# EAGLE design HKCV5 (EAGLE 9.6.2)
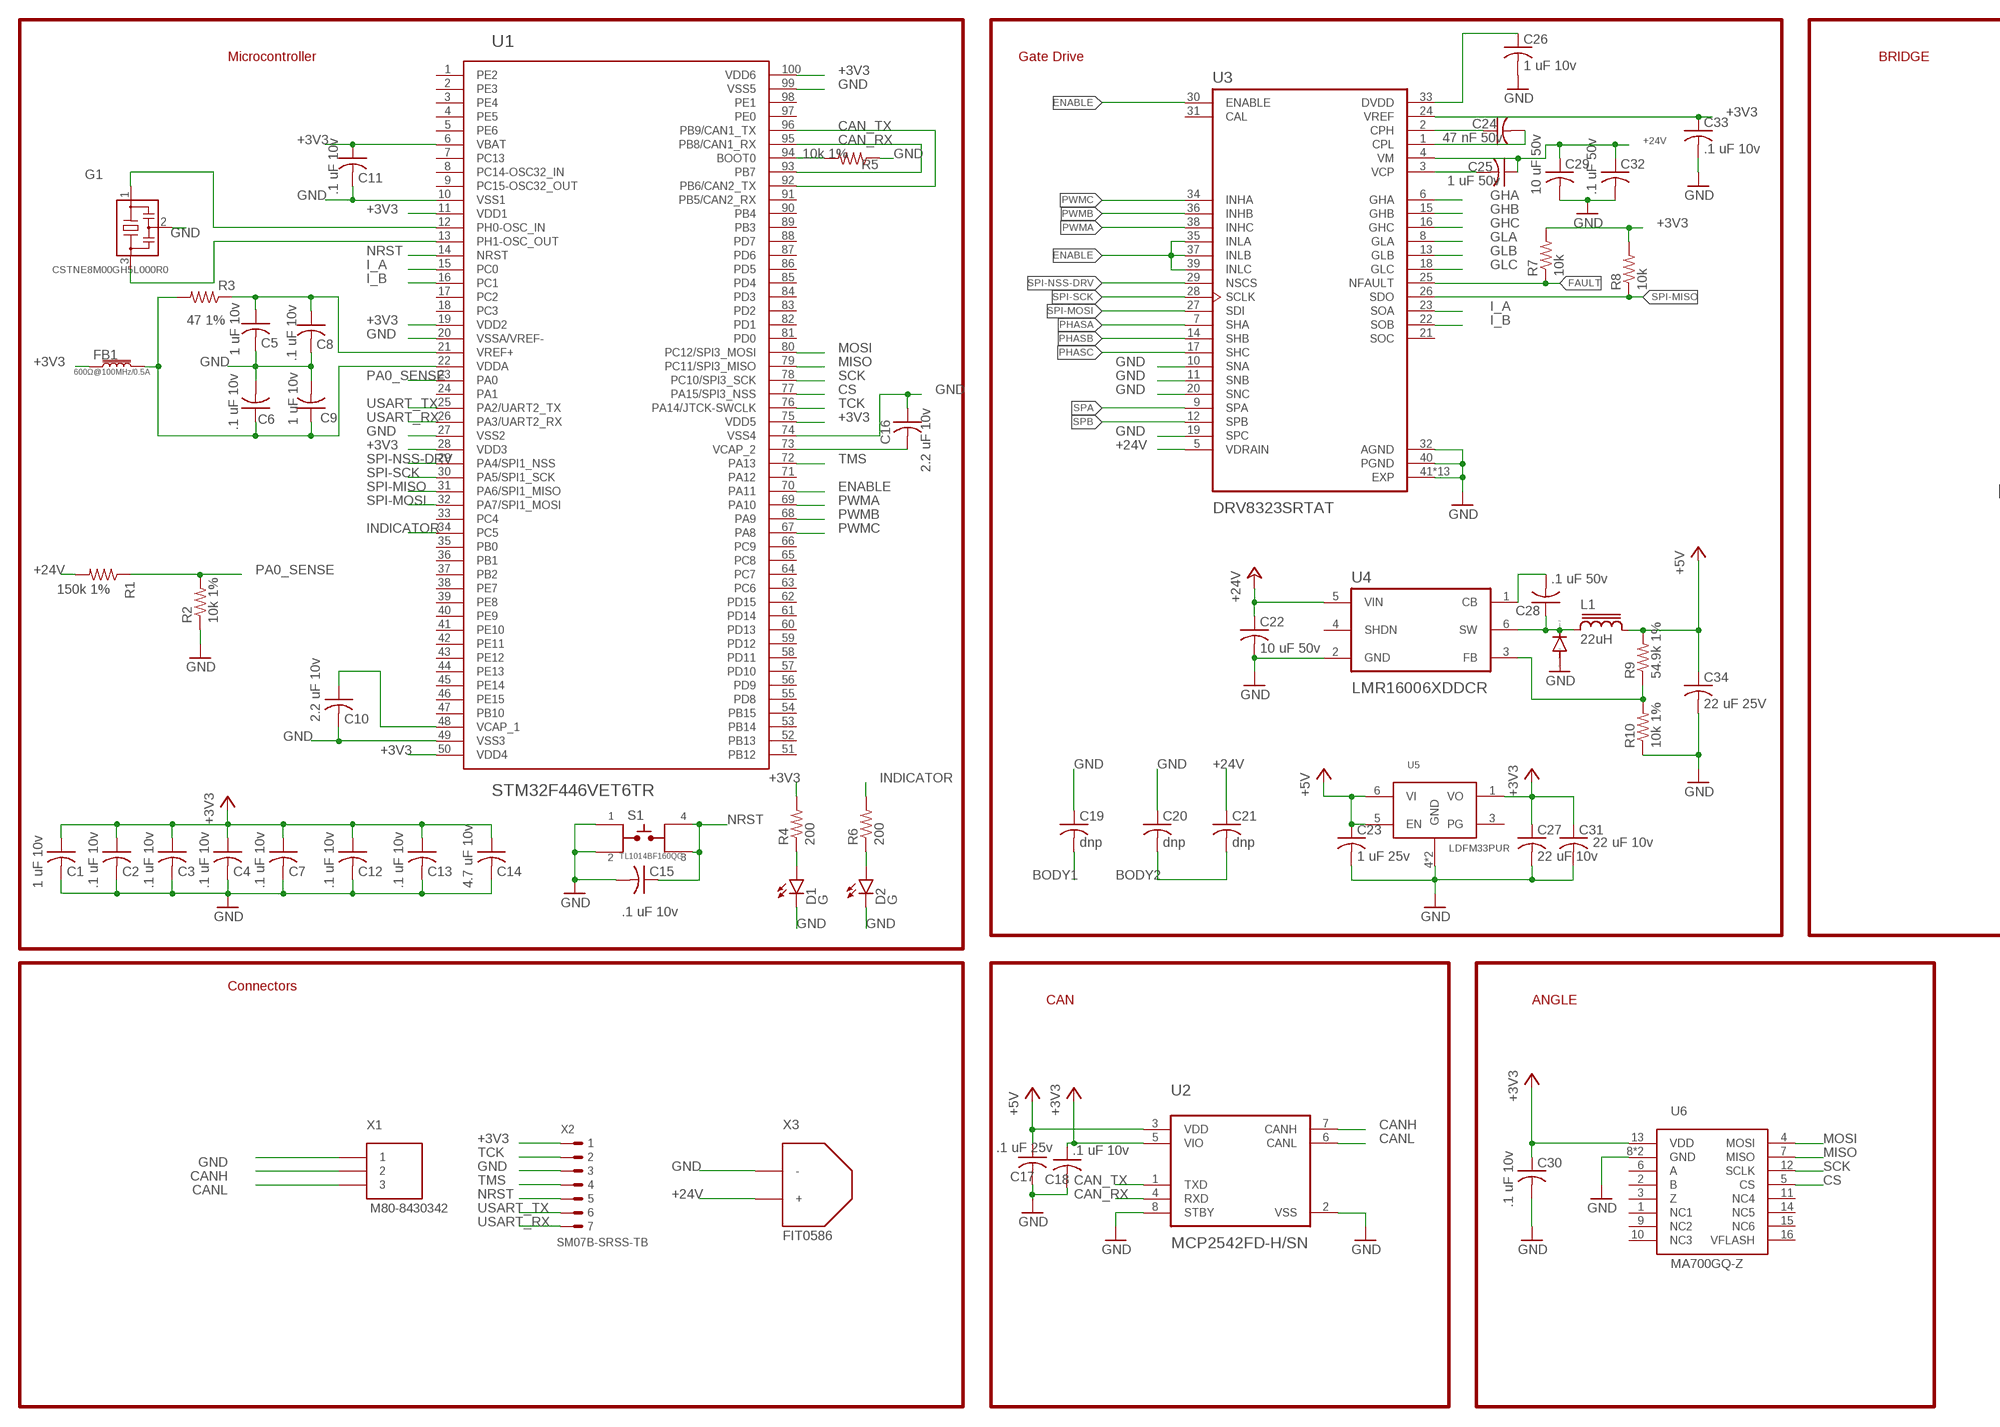
[diagram p0: schematic, sheet 1, part 1 of 2]
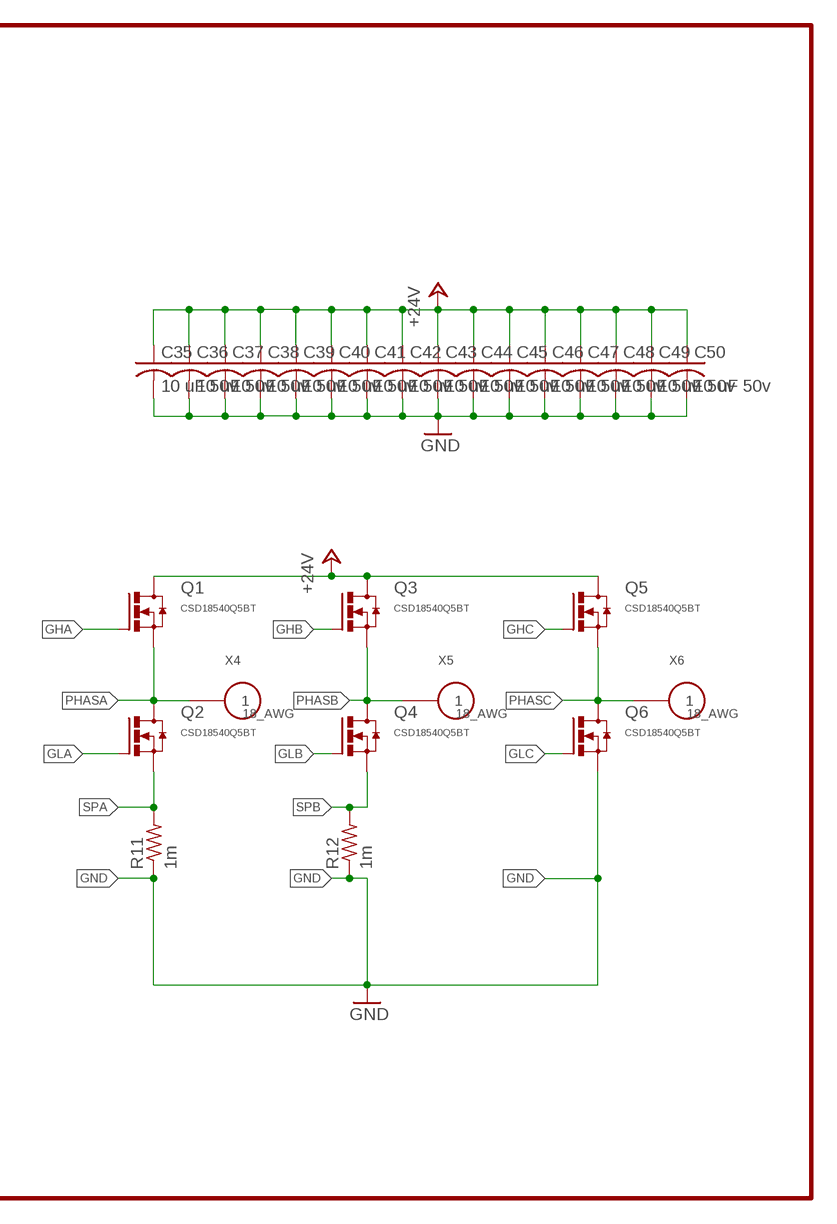
[diagram p1: schematic, sheet 1, part 2 of 2]

## Parts
C1  1 uF 10v  C-USC0402K  [C0402K]
C2  .1 uF 10v  C-USC0402K  [C0402K]
C3  .1 uF 10v  C-USC0402K  [C0402K]
C4  .1 uF 10v  C-USC0402K  [C0402K]
C5  1 uF 10v  C-USC0402K  [C0402K]
C6  .1 uF 10v  C-USC0402K  [C0402K]
C7  .1 uF 10v  C-USC0402K  [C0402K]
C8  .1 uF 10v  C-USC0402K  [C0402K]
C9  1 uF 10v  C-USC0402K  [C0402K]
C10  2.2 uF 10v  C-USC0402K  [C0402K]
C11  .1 uF 10v  C-USC0402K  [C0402K]
C12  .1 uF 10v  C-USC0402K  [C0402K]
C13  .1 uF 10v  C-USC0402K  [C0402K]
C14  4.7 uF 10v  C-USC0402K  [C0402K]
C15  .1 uF 10v  C-USC0402K  [C0402K]
C16  2.2 uF 10v  C-USC0402K  [C0402K]
C17  .1 uF 25v  C-USC0402K  [C0402K]
C18  .1 uF 10v  C-USC0402K  [C0402K]
C19  dnp  C-USC0402K  [C0402K]
C20  dnp  C-USC0402K  [C0402K]
C21  dnp  C-USC0402K  [C0402K]
C22  10 uF 50v  C-USC1206K  [C1206K]
C23  1 uF 25v  C-USC0402K  [C0402K]
C24  47 nF 50v  C-USC0402K  [C0402K]
C25  1 uF 50v  C-USC0603K  [C0603K]
C26  1 uF 10v  C-USC0402K  [C0402K]
C27  22 uF 10v  C-USC0603K  [C0603K]
C28  .1 uF 50v  C-USC0603K  [C0603K]
C29  10 uF 50v  C-USC1206K  [C1206K]
C30  .1 uF 10v  C-USC0402K  [C0402K]
C31  22 uF 10v  C-USC0603K  [C0603K]
C32  .1 uF 50v  C-USC0603K  [C0603K]
C33  .1 uF 10v  C-USC0402K  [C0402K]
C34  22 uF 25V  C-USC0805K  [C0805K]
C35  10 uF 50v  C-USC1206K  [C1206K]
C36  10 uF 50v  C-USC1206K  [C1206K]
C37  10 uF 50v  C-USC1206K  [C1206K]
C38  10 uF 50v  C-USC1206K  [C1206K]
C39  10 uF 50v  C-USC1206K  [C1206K]
C40  10 uF 50v  C-USC1206K  [C1206K]
C41  10 uF 50v  C-USC1206K  [C1206K]
C42  10 uF 50v  C-USC1206K  [C1206K]
C43  10 uF 50v  C-USC1206K  [C1206K]
C44  10 uF 50v  C-USC1206K  [C1206K]
C45  10 uF 50v  C-USC1206K  [C1206K]
C46  10 uF 50v  C-USC1206K  [C1206K]
C47  10 uF 50v  C-USC1206K  [C1206K]
C48  10 uF 50v  C-USC1206K  [C1206K]
C49  10 uF 50v  C-USC1206K  [C1206K]
C50  10 uF 50v  C-USC1206K  [C1206K]
D1  G  LED0603  [LED-0603]
D2  G  LED0603  [LED-0603]
D3  500 mA 60v  DIODE-SOD123  [SOD123]
FB1  600Ω@100MHz/0.5A  FERRITE_BEAD-0603  [0603]
G1  CSTNE8M00GH5L000R0  [CSTCE]
L1  22uH  SDR0302  [SDR0302]
Q1  CSD18540Q5BT  [8-POWERTDFN]
Q2  CSD18540Q5BT  [8-POWERTDFN]
Q3  CSD18540Q5BT  [8-POWERTDFN]
Q4  CSD18540Q5BT  [8-POWERTDFN]
Q5  CSD18540Q5BT  [8-POWERTDFN]
Q6  CSD18540Q5BT  [8-POWERTDFN]
R1  150k 1%  R-US_R0402  [R0402]
R2  10k 1%  R-US_R0402  [R0402]
R3  47 1%  R-US_R0402  [R0402]
R4  200  R-US_R0402  [R0402]
R5  10k 1%  R-US_R0402  [R0402]
R6  200  R-US_R0402  [R0402]
R7  10k  R-US_R0402  [R0402]
R8  10k  R-US_R0402  [R0402]
R9  54.9k 1%  R-US_R0402  [R0402]
R10  10k 1%  R-US_R0402  [R0402]
R11  1m  R-US_R1210  [R1210]
R12  1m  R-US_R1210  [R1210]
S1  TL1014BF160QG  [TL1014]
U1  STM32F446VET6TR  [LQFP100]
U2  MCP2542FD-H/SN  [8-LEADSOIC]
U3  DRV8323SRTAT  [RTA-PACKAGE]
U4  LMR16006XDDCR  [SOT-23-6-THIN]
U5  LDFM33PUR  [DFN6-3X3]
U6  MA700GQ-Z  MA700GQ-Z  [QFN16]
X1  M80-8430342  M80-3-PIN  [M80-8430342]
X2  SM07B-SRSS-TB  [SM07B-SRSS-TB]
X3  FIT0586  [XT30]
X4  18_AWG  18_AWG_PADSINGLE  [18_AWG_PAD]
X5  18_AWG  18_AWG_PADSINGLE  [18_AWG_PAD]
X6  18_AWG  18_AWG_PADSINGLE  [18_AWG_PAD]

## Nets
+3V3 [supply1]: C1.1 C2.1 C3.1 C4.1 C7.1 C11.1 C12.1 C13.1 C14.1 C18.1 C27.1 C30.1 C31.1 C33.1 FB1.1 R4.2 R7.2 R8.2 U1.6(VBAT) U1.11(VDD1) U1.19(VDD2) U1.28(VDD3) U1.50(VDD4) U1.75(VDD5) U1.100(VDD6) U2.5(VIO) U3.24(VREF) U5.1(VO) U6.13(VDD) X2.1
+5V [supply1]: C17.1 C23.1 C34.1 L1.2 R9.2 U2.3(VDD) U5.5(EN) U5.6(VI)
+24V [supply1]: C21.1 C22.1 C25.1 C29.1 C32.1 C35.1 C36.1 C37.1 C38.1 C39.1 C40.1 C41.1 C42.1 C43.1 C44.1 C45.1 C46.1 C47.1 C48.1 C49.1 C50.1 Q1.5_1(D) Q1.5_2(D) Q1.5_3(D) Q1.5_4(D) Q1.5_5(D) Q1.5_6(D) Q1.5_7(D) Q1.5_8(D) Q1.5_9(D) Q1.5_10(D) Q1.5_11(D) Q1.5_12(D) Q1.5_13(D) Q1.5_14(D) Q1.5_15(D) Q1.5_16(D) Q1.5_17(D) Q1.5_18(D) Q1.5_19(D) Q1.5_20(D) Q1.5_21(D) Q1.5_22(D) Q1.5_23(D) Q1.5_24(D) Q1.5_25(D) Q1.5_26(D) Q1.5_27(D) Q1.5_28(D) Q1.5_29(D) Q1.5_30(D) Q3.5_1(D) Q3.5_2(D) Q3.5_3(D) Q3.5_4(D) Q3.5_5(D) Q3.5_6(D) Q3.5_7(D) Q3.5_8(D) Q3.5_9(D) Q3.5_10(D) Q3.5_11(D) Q3.5_12(D) Q3.5_13(D) Q3.5_14(D) Q3.5_15(D) Q3.5_16(D) Q3.5_17(D) Q3.5_18(D) Q3.5_19(D) Q3.5_20(D) Q3.5_21(D) Q3.5_22(D) Q3.5_23(D) Q3.5_24(D) Q3.5_25(D) Q3.5_26(D) Q3.5_27(D) Q3.5_28(D) Q3.5_29(D) Q3.5_30(D) Q5.5_1(D) Q5.5_2(D) Q5.5_3(D) Q5.5_4(D) Q5.5_5(D) Q5.5_6(D) Q5.5_7(D) Q5.5_8(D) Q5.5_9(D) Q5.5_10(D) Q5.5_11(D) Q5.5_12(D) Q5.5_13(D) Q5.5_14(D) Q5.5_15(D) Q5.5_16(D) Q5.5_17(D) Q5.5_18(D) Q5.5_19(D) Q5.5_20(D) Q5.5_21(D) Q5.5_22(D) Q5.5_23(D) Q5.5_24(D) Q5.5_25(D) Q5.5_26(D) Q5.5_27(D) Q5.5_28(D) Q5.5_29(D) Q5.5_30(D) R1.2 U3.4(VM) U3.5(VDRAIN) U4.5(VIN) X3.+
BODY1: C19.2
BODY2: C20.2 C21.2
BOOT0: R5.2 U1.94(BOOT0)
CAN_RX: U1.93(PB7) U1.95(PB8/CAN1_RX) U2.4(RXD)
CAN_TX: U1.92(PB6/CAN2_TX) U1.96(PB9/CAN1_TX) U2.1(TXD)
CANH: U2.7(CANH) X1.2
CANL: U2.6(CANL) X1.3
CB [buck_converter]: C28.2 U4.1(CB)
CPH: C24.1 U3.2(CPH)
CPL: C24.2 U3.1(CPL)
CS: U1.77(PA15/SPI3_NSS) U6.5(CS)
D1: D1.A R4.1
D2: D2.A R6.1
DVDD [gate_drive]: C26.1 U3.33(DVDD)
ENABLE: U1.70(PA11) U3.30(ENABLE) U3.35(INLA) U3.37(INLB) U3.39(INLC)
FAULT: R7.1 U3.25(NFAULT)
FB [buck_converter]: R9.1 R10.2 U4.3(FB)
GHA [gate_drive]: Q1.4(G) U3.6(GHA)
GHB [gate_drive]: Q3.4(G) U3.15(GHB)
GHC [gate_drive]: Q5.4(G) U3.16(GHC)
GLA [gate_drive]: Q2.4(G) U3.8(GLA)
GLB [gate_drive]: Q4.4(G) U3.13(GLB)
GLC [gate_drive]: Q6.4(G) U3.18(GLC)
GND: C1.2 C2.2 C3.2 C4.2 C5.2 C6.2 C7.2 C8.2 C9.2 C10.2 C11.2 C12.2 C13.2 C14.2 C15.2 C16.1 C17.2 C18.2 C19.1 C20.1 C22.2 C23.2 C26.2 C27.2 C29.2 C30.2 C31.2 C32.2 C33.2 C34.2 C35.2 C36.2 C37.2 C38.2 C39.2 C40.2 C41.2 C42.2 C43.2 C44.2 C45.2 C46.2 C47.2 C48.2 C49.2 C50.2 D1.C D2.C D3.A G1.2 Q6.1(S) Q6.2(S) Q6.3(S) R2.1 R5.1 R10.1 R11.1 R12.1 S1.1 S1.2 U1.10(VSS1) U1.20(VSSA/VREF-) U1.27(VSS2) U1.49(VSS3) U1.74(VSS4) U1.99(VSS5) U2.2(VSS) U2.8(STBY) U3.10(SNA) U3.11(SNB) U3.19(SPC) U3.20(SNC) U3.32(AGND) U3.40(PGND) U3.41(EXP) U3.41_1(EXP) U3.41_2(EXP) U3.41_3(EXP) U3.41_4(EXP) U3.41_5(EXP) U3.41_6(EXP) U3.41_7(EXP) U3.41_8(EXP) U3.41_9(EXP) U3.41_10(EXP) U3.41_11(EXP) U3.41_12(EXP) U4.2(GND) U5.4(GND) U5.EXP(GND) U6.8(GND) U6.TH(GND) X1.1 X2.3 X3.-
I_A: U1.15(PC0) U3.23(SOA)
I_B: U1.16(PC1) U3.22(SOB)
INDICATOR: R6.2 U1.34(PC5)
MISO: U1.79(PC11/SPI3_MISO) U6.7(MISO)
MOSI: U1.80(PC12/SPI3_MOSI) U6.4(MOSI)
NRST: C15.1 S1.3 S1.4 U1.14(NRST) X2.5
OSC_IN: G1.1 U1.12(PH0-OSC_IN)
OSC_OUT: G1.3 U1.13(PH1-OSC_OUT)
PA0_SENSE: R1.1 R2.2 U1.23(PA0)
PHASA: Q1.1(S) Q1.2(S) Q1.3(S) Q2.5_1(D) Q2.5_2(D) Q2.5_3(D) Q2.5_4(D) Q2.5_5(D) Q2.5_6(D) Q2.5_7(D) Q2.5_8(D) Q2.5_9(D) Q2.5_10(D) Q2.5_11(D) Q2.5_12(D) Q2.5_13(D) Q2.5_14(D) Q2.5_15(D) Q2.5_16(D) Q2.5_17(D) Q2.5_18(D) Q2.5_19(D) Q2.5_20(D) Q2.5_21(D) Q2.5_22(D) Q2.5_23(D) Q2.5_24(D) Q2.5_25(D) Q2.5_26(D) Q2.5_27(D) Q2.5_28(D) Q2.5_29(D) Q2.5_30(D) U3.7(SHA) X4.1
PHASB: Q3.1(S) Q3.2(S) Q3.3(S) Q4.5_1(D) Q4.5_2(D) Q4.5_3(D) Q4.5_4(D) Q4.5_5(D) Q4.5_6(D) Q4.5_7(D) Q4.5_8(D) Q4.5_9(D) Q4.5_10(D) Q4.5_11(D) Q4.5_12(D) Q4.5_13(D) Q4.5_14(D) Q4.5_15(D) Q4.5_16(D) Q4.5_17(D) Q4.5_18(D) Q4.5_19(D) Q4.5_20(D) Q4.5_21(D) Q4.5_22(D) Q4.5_23(D) Q4.5_24(D) Q4.5_25(D) Q4.5_26(D) Q4.5_27(D) Q4.5_28(D) Q4.5_29(D) Q4.5_30(D) U3.14(SHB) X5.1
PHASC: Q5.1(S) Q5.2(S) Q5.3(S) Q6.5_1(D) Q6.5_2(D) Q6.5_3(D) Q6.5_4(D) Q6.5_5(D) Q6.5_6(D) Q6.5_7(D) Q6.5_8(D) Q6.5_9(D) Q6.5_10(D) Q6.5_11(D) Q6.5_12(D) Q6.5_13(D) Q6.5_14(D) Q6.5_15(D) Q6.5_16(D) Q6.5_17(D) Q6.5_18(D) Q6.5_19(D) Q6.5_20(D) Q6.5_21(D) Q6.5_22(D) Q6.5_23(D) Q6.5_24(D) Q6.5_25(D) Q6.5_26(D) Q6.5_27(D) Q6.5_28(D) Q6.5_29(D) Q6.5_30(D) U3.17(SHC) X6.1
PWMA: U1.69(PA10) U3.38(INHC)
PWMB: U1.68(PA9) U3.36(INHB)
PWMC: U1.67(PA8) U3.34(INHA)
SCK: U1.78(PC10/SPI3_SCK) U6.12(SCLK)
SPA: Q2.1(S) Q2.2(S) Q2.3(S) R11.2 U3.9(SPA)
SPB: Q4.1(S) Q4.2(S) Q4.3(S) R12.2 U3.12(SPB)
SPI-MISO: R8.1 U1.31(PA6/SPI1_MISO) U3.26(SDO)
SPI-MOSI: U1.32(PA7/SPI1_MOSI) U3.27(SDI)
SPI-NSS-DRV: U1.29(PA4/SPI1_NSS) U3.29(NSCS)
SPI-SCK: U1.30(PA5/SPI1_SCK) U3.28(SCLK)
SW [buck_converter]: C28.1 D3.C L1.1 U4.6(SW)
TCK: U1.76(PA14/JTCK-SWCLK) X2.2
TMS: U1.72(PA13) X2.4
USART_RX: U1.26(PA3/UART2_RX) X2.7
USART_TX: U1.25(PA2/UART2_TX) X2.6
VCAP_1: C10.1 U1.48(VCAP_1)
VCAP_2: C16.2 U1.73(VCAP_2)
VCP [gate_drive]: C25.2 U3.3(VCP)
VDDA: C6.1 C9.1 FB1.2 R3.2 U1.22(VDDA)
VREF+: C5.1 C8.1 R3.1 U1.21(VREF+)
Unconnected: U1.1(PE2) U1.2(PE3) U1.3(PE4) U1.4(PE5) U1.5(PE6) U1.7(PC13) U1.8(PC14-OSC32_IN) U1.9(PC15-OSC32_OUT) U1.17(PC2) U1.18(PC3) U1.24(PA1) U1.33(PC4) U1.35(PB0) U1.36(PB1) U1.37(PB2) U1.38(PE7) U1.39(PE8) U1.40(PE9) U1.41(PE10) U1.42(PE11) U1.43(PE12) U1.44(PE13) U1.45(PE14) U1.46(PE15) U1.47(PB10) U1.51(PB12) U1.52(PB13) U1.53(PB14) U1.54(PB15) U1.55(PD8) U1.56(PD9) U1.57(PD10) U1.58(PD11) U1.59(PD12) U1.60(PD13) U1.61(PD14) U1.62(PD15) U1.63(PC6) U1.64(PC7) U1.65(PC8) U1.66(PC9) U1.71(PA12) U1.81(PD0) U1.82(PD1) U1.83(PD2) U1.84(PD3) U1.85(PD4) U1.86(PD5) U1.87(PD6) U1.88(PD7) U1.89(PB3) U1.90(PB4) U1.91(PB5/CAN2_RX) U1.97(PE0) U1.98(PE1) U3.21(SOC) U3.31(CAL) U4.4(SHDN) U5.3(PG) U6.1(NC1) U6.2(B) U6.3(Z) U6.6(A) U6.9(NC2) U6.10(NC3) U6.11(NC4) U6.14(NC5) U6.15(NC6) U6.16(VFLASH)

## Notes on the sheet
- Microcontroller | Gate Drive | BRIDGE
- Connectors
- CAN | ANGLE

## Library data of the parts
C1-C50 = rcl:C-US: CAPACITOR, American symbol; SPICEPREFIX: C
D1 D2 = SparkFun-LED:LED: LED (Generic) Standard schematic elements and footprints for 5mm, 3mm, 1206, and 0603 sized LEDs. Generic LEDs with no color specified.
D3 = diode:DIODE-: DIODE
FB1 = SparkFun-Coils:FERRITE_BEAD: Ferrite Bead (blocks, cores, rings, chokes, etc.) Inductor with layers of ferrite used to suppress high frequencies. Often used to isolate high frequency noise. SparkFun Products: IOIO-OTG - V2.2 <https://www.sparkfun.com/products/13613> SparkFun SAMD21 Mini Breakout <https://www.sparkfun.com/products/13664> SparkFun 6 Degrees of Freedom Breakout - LSM6DS3 <https://www.sparkfun.com/products/13339> SparkFun SAMD21 Dev Breakout <https://www.sparkfun.com/products/13672>; PROD_ID: NDUC-07859; VALUE: 30Ω/1.8A
G1 = HKCV4:CSTNE8M00GH5L000R0: CSTNE8M00GH5L000R0
L1 = inductor-bourns:SDR0302: POWER INDUCTOR
Q1-Q6 = VaskoCustom:CSD18540Q5BT: CSD18540Q5B 60-V, N-ChannelNexFET™ PowerMOSFETs Texas Instruments
R1-R12 = rcl:R-US_: RESISTOR, American symbol; SPICEPREFIX: R
S1 = VaskoCustom:TL1014BF160QG: TL1014BF160QG Switch RATING: 12VDC, 50mA. MECHANICAL/ELECTRICAL LIFE 200,000 CYCLES MIN.
U1 = VaskoCustom:STM32F446VET6TR: STM32F446VET6TR Arm® Cortex®-M4 32-bit MCU+FPU, 225 DMIPS, up to 512 KB Flash/128+4 KB RAM, USB OTG HS/FS, seventeen TIMs, three ADCs and twenty communication interfaces
U2 = VaskoCustom:MCP2542FD-H/SN: MCP2542FD-H/SN CAN FD Transceiver
U3 = VaskoCustom:DRV8323SRTAT: DRV8323SRTAT 6 to 60-V Three-PhaseSmartGate Driver
U4 = VaskoCustom:LMR16006XDDCR: LMR16006XDDCR SIMPLESWITCHER®60 V 0.6 A Buck RegulatorsWith High Efficiency ECO Mode Texas Instruments
U5 = HKCV4:LDFM33PUR
U6 = HKCV4:MA700GQ-Z: MA700GQ-Z
X1 = HKCV4:M80-3-PIN: M80-8430342
X2 = HKCV4:SM07B-SRSS-TB: SM07B-SRSS-TB 1.0 mm pitch/Disconnectable Crimp style connectors
X3 = VaskoCustom:FIT0586
X4-X6 = HKCV4:18_AWG_PAD: 18_AWG

## Net classes
1 gate_drive: width 0.2 mm, clearance 0.25 mm
2 supply1: width 0.2 mm, clearance 0.152 mm

## Board
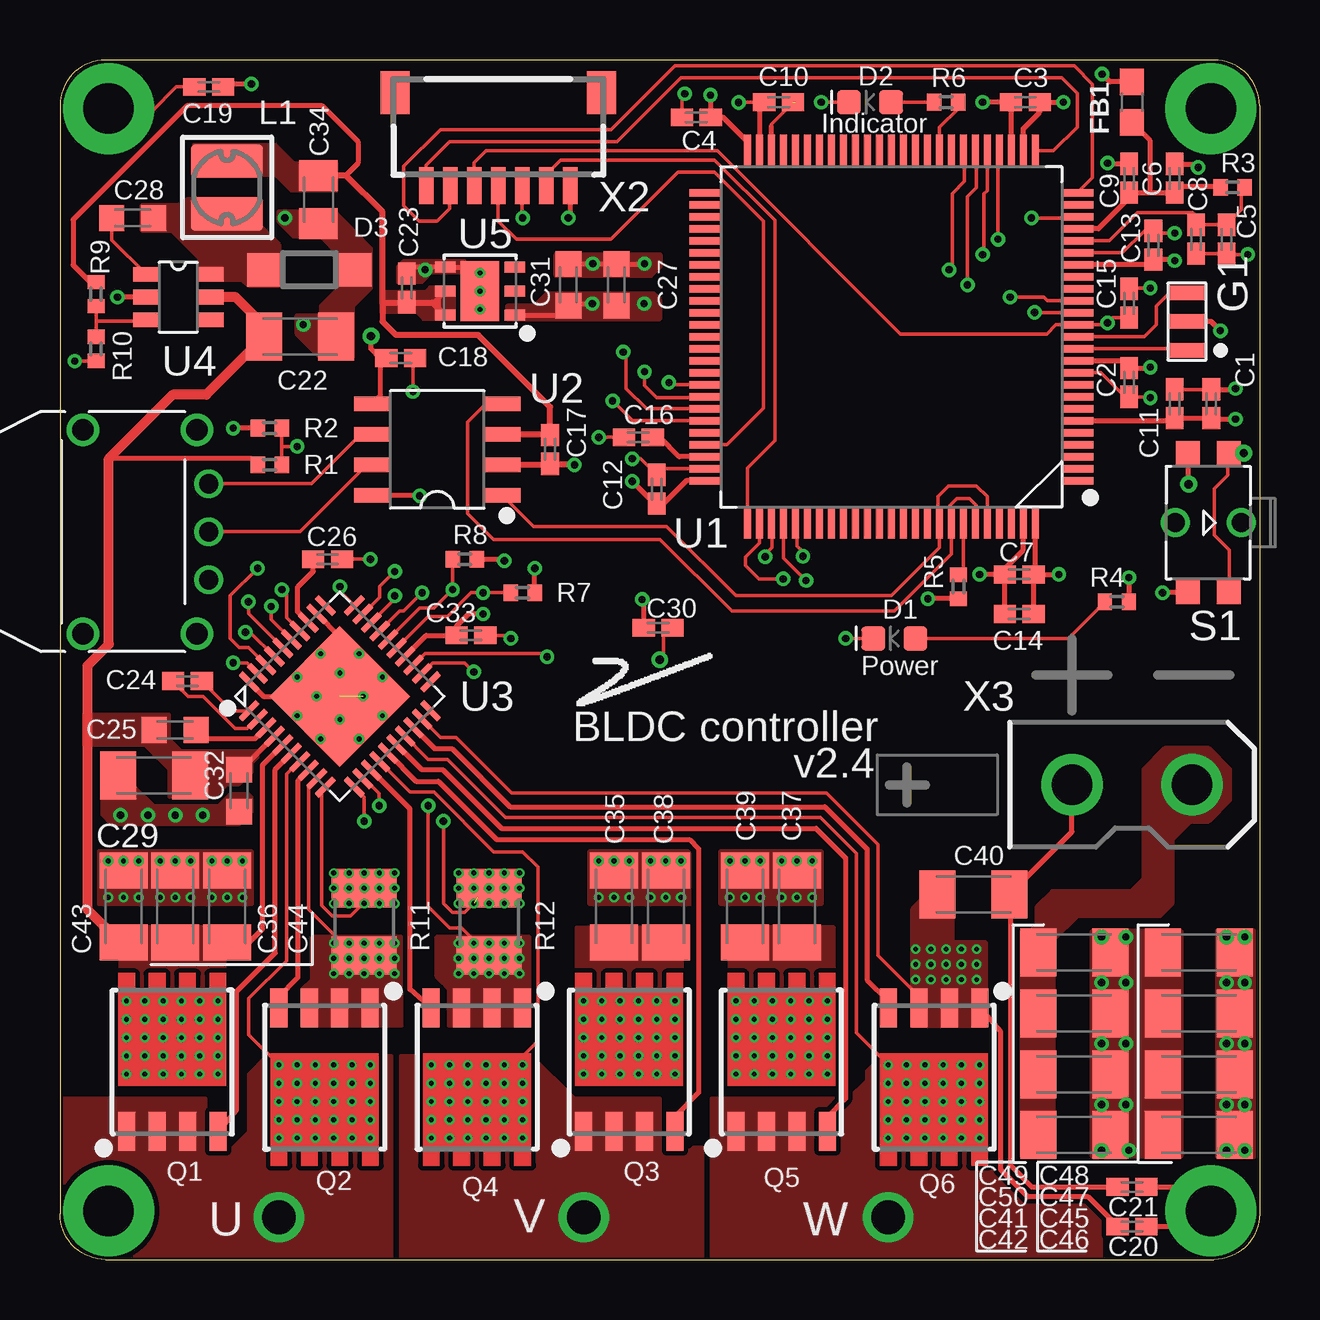
[diagram p2: board, top side]
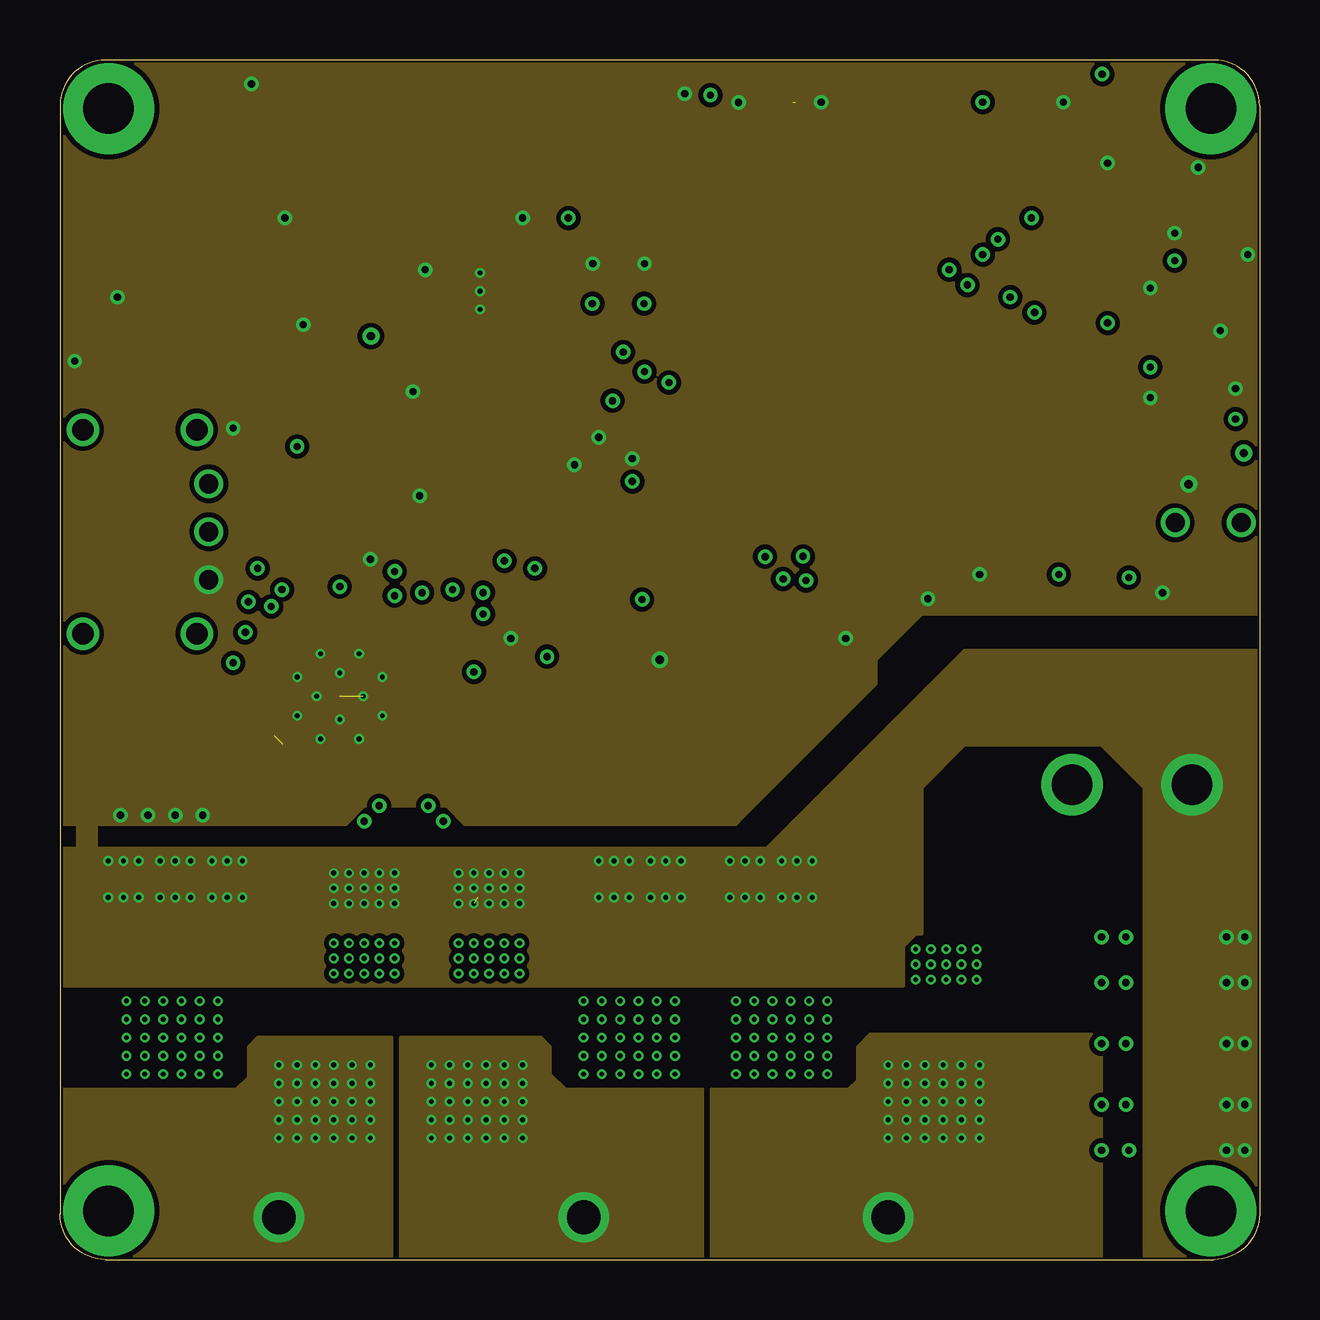
[diagram p3: board, inner layer Ground]
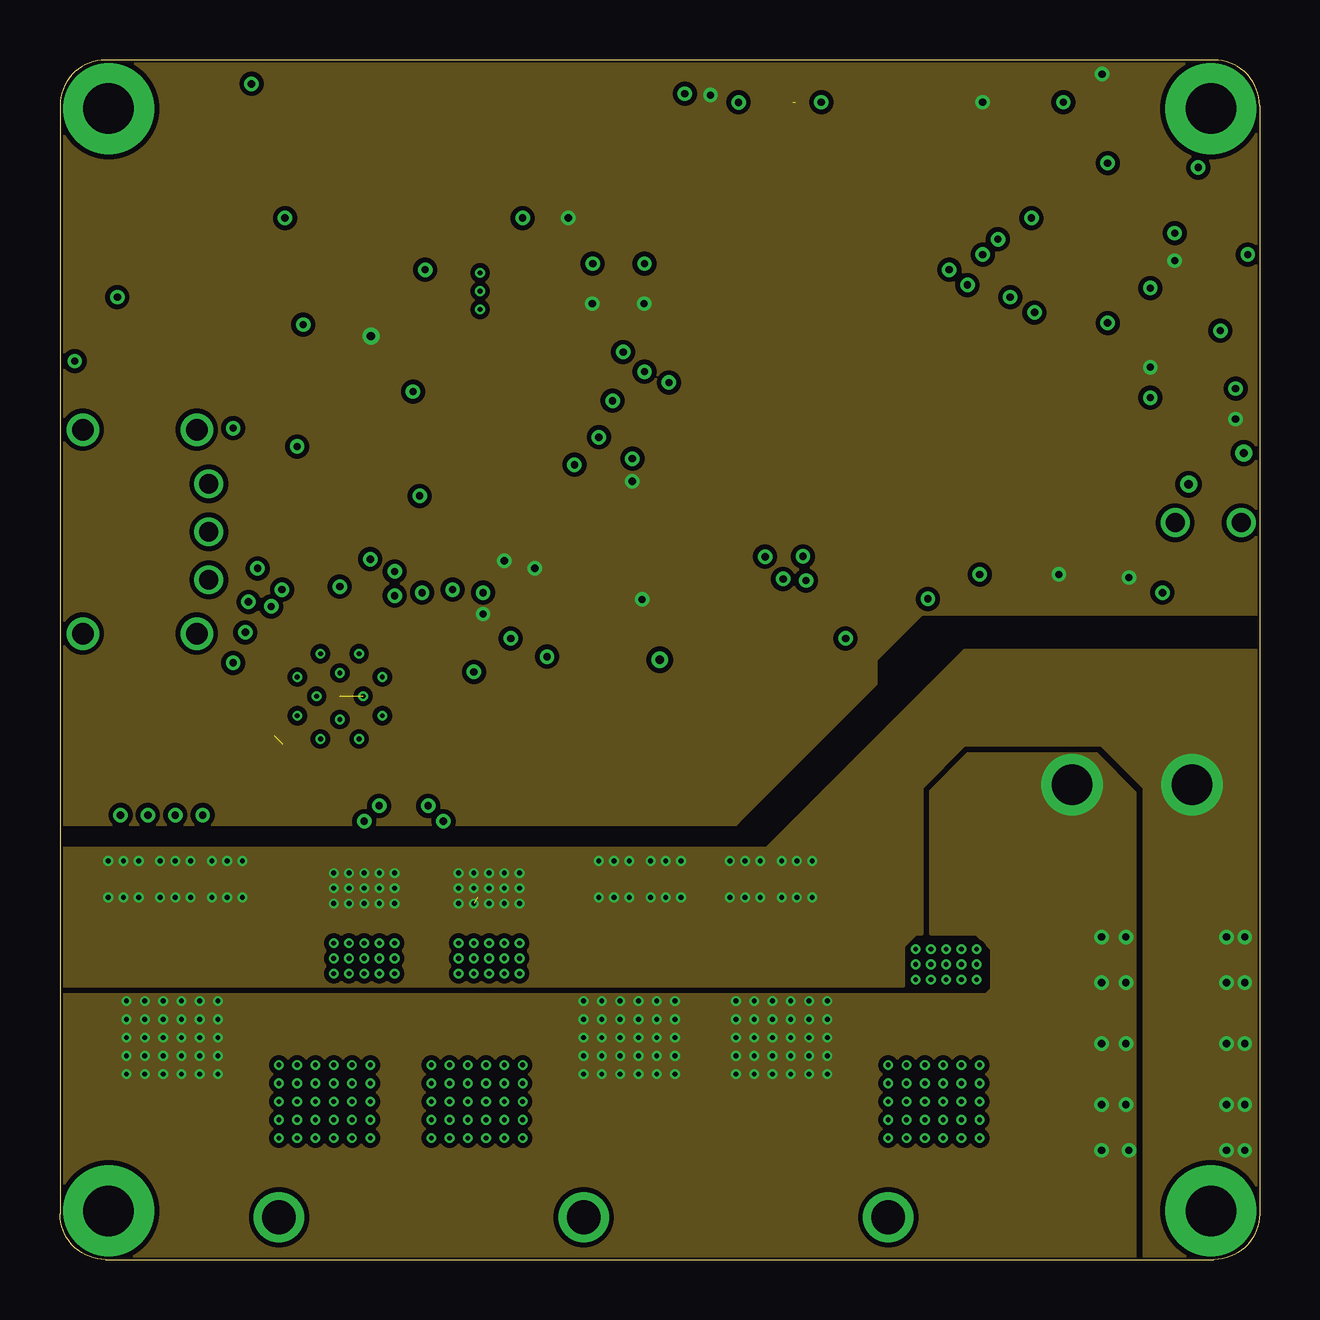
[diagram p4: board, inner layer Power]
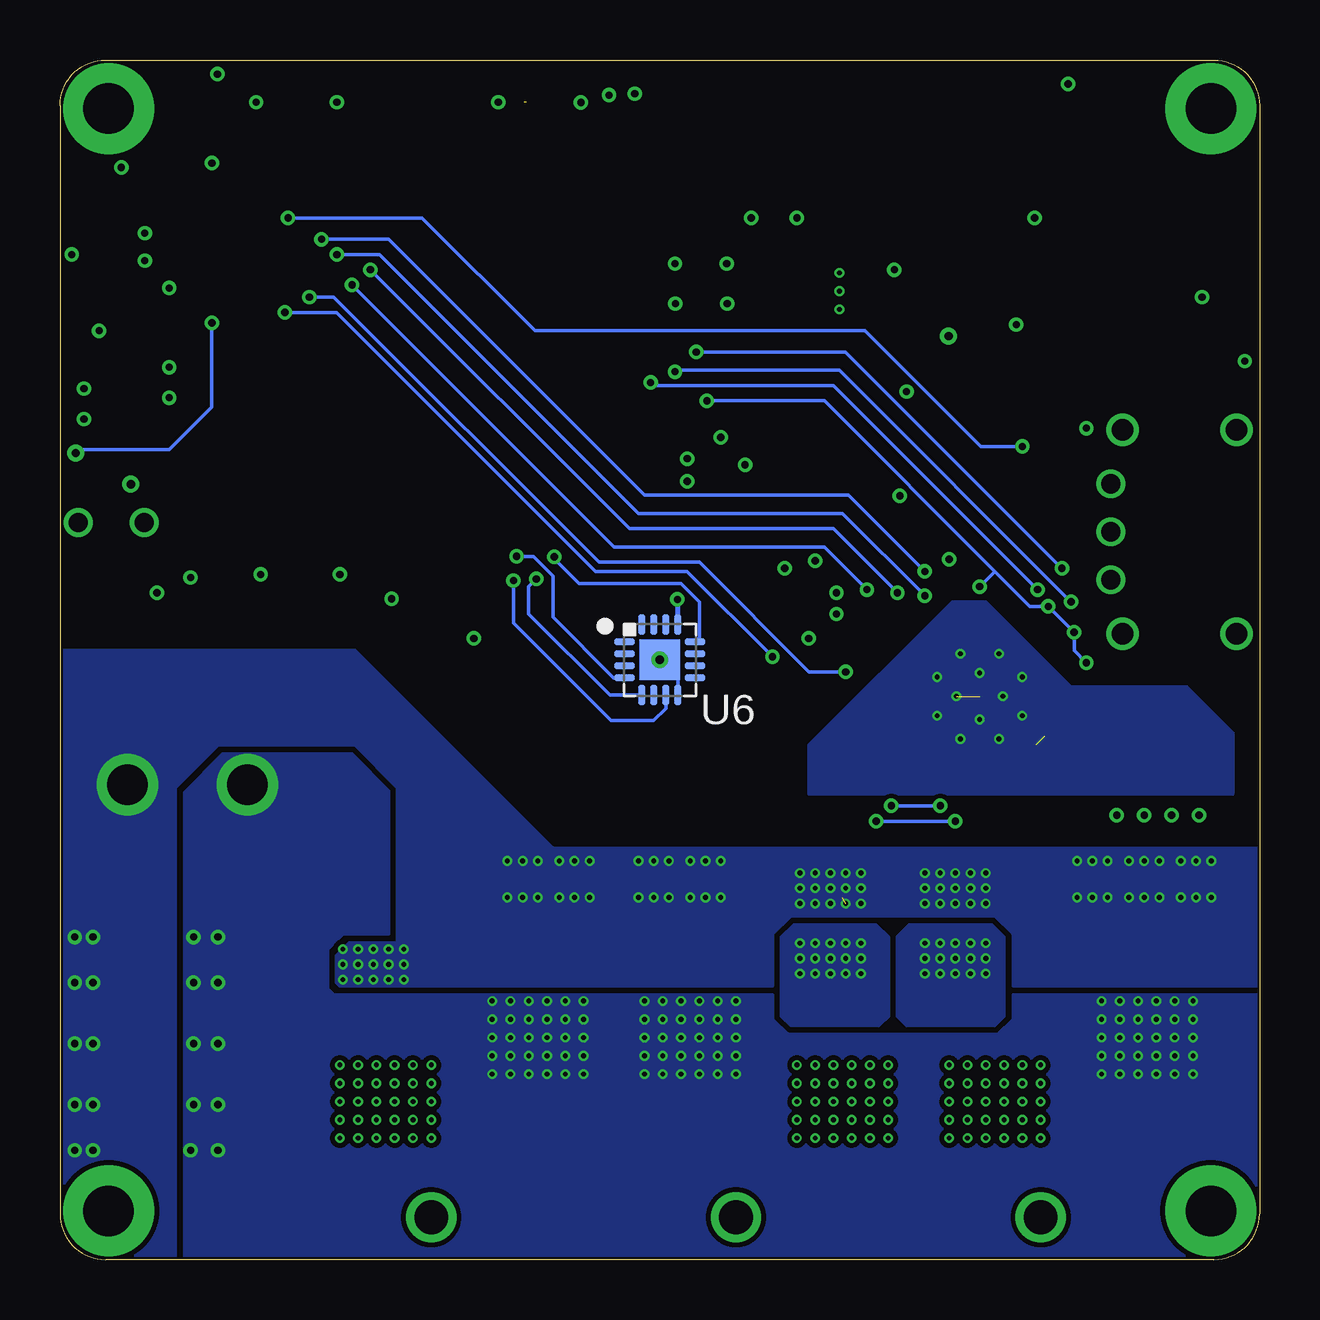
[diagram p5: board, bottom side, seen from below]

Size 50 x 50 mm. Coordinates in mm from the lower left corner, seen from the top.
Outline: 1.9,0 48.1,0 arc90 50,1.9 50,48.1 arc90 48.1,50 1.9,50 arc90 0,48.1 0,1.9 arc90 1.9,0
Copper layers (1+2*15+16): Top 0.035mm / dielectric 0.24mm / Ground 0.035mm / dielectric 1.38mm / Power 0.035mm / dielectric 0.24mm / Bottom 0.035mm
Design rules "default *": minimum track width 6mil, minimum drill 0.2mm, track to track 0.2mm, track to pad 0.2mm, pad to pad 0.2mm, via to via 0.2mm, smd to smd 5mil, copper to edge 4mil, drill to drill 10mil, minimum pad ring 4mil, minimum via ring 4mil, stop-mask expansion 0.05mm, vias tented up to drill 0mil, thermal gap 10mil

### Footprints (pad centres in the part's own frame; a part is rotated, then mirrored left to right if it is on the bottom)
C0402K = smd 0.925 x 0.74: 1 -0.6,0; 2 0.6,0
C1206K = smd 1.5 x 2: 1 -1.5,0; 2 1.5,0
C0603K = smd 1.05 x 1.08: 1 -0.875,0; 2 0.875,0
C0805K = smd 1.3 x 1.6: 1 -1,0; 2 1,0
LED-0603 = smd 1 x 1: A -0.877,0; C 0.877,0
SOD123 = smd 1.4 x 1.4: A 1.9,0; C -1.9,0
0603 = smd 1.1 x 1: 1 -0.85,0; 2 0.85,0
CSTCE = smd 0.6 x 1.6: 1 -1.2,0; 2 0,0; 3 1.2,0
SDR0302 = smd 3 x 1.4: 1 0,1.1; 2 0,-1.1
8-POWERTDFN = smd 1.626 x 0.71: 1 2.897,-1.905; 2 2.897,-0.635; 3 2.897,0.635; 4 2.897,1.905 | drill 0.2 pad 0.4: 5_1 -2.54,1.905; 5_2 -1.778,1.905; 5_3 -1.016,1.905; 5_4 -0.254,1.905; 5_5 0.508,1.905; 5_6 -2.54,1.143; 5_7 -1.778,1.143; 5_8 -1.016,1.143; 5_9 -0.254,1.143; 5_10 0.508,1.143; 5_11 0.508,0.381; 5_12 -0.254,0.381; 5_13 -1.016,0.381; 5_14 -1.778,0.381; 5_15 -2.54,0.381; 5_16 -2.54,-0.381; 5_17 -1.778,-0.381; 5_18 -1.016,-0.381; 5_19 -0.254,-0.381; 5_20 0.508,-0.381; 5_21 0.508,-1.143; 5_22 -0.254,-1.143; 5_23 -1.016,-1.143; 5_24 -1.778,-1.143; 5_25 -2.54,-1.143; 5_26 -2.54,-1.905; 5_27 -1.778,-1.905; 5_28 -1.016,-1.905; 5_29 -0.254,-1.905; 5_30 0.508,-1.905
R0402 = smd 0.6 x 0.7: 1 -0.5,0; 2 0.5,0
R1210 = smd 1.6 x 2.7: 1 -1.4,0; 2 1.4,0
TL1014 = smd 1 x 1: 1 2.9,0.85; 2 -2.9,0.85; 3 -2.9,-0.85; 4 2.9,-0.85 | drill 0.8: A1 0,1.375; A2 0,-1.375
LQFP100 = smd 1.327 x 0.3: 1 -7.75,6; 2 -7.75,5.5; 3 -7.75,5; 4 -7.75,4.5; 5 -7.75,4; 6 -7.75,3.5; 7 -7.75,3; 8 -7.75,2.5; 9 -7.75,2; 10 -7.75,1.5; 11 -7.75,1; 12 -7.75,0.5; 13 -7.75,0; 14 -7.75,-0.5; 15 -7.75,-1; 16 -7.75,-1.5; 17 -7.75,-2; 18 -7.75,-2.5; 19 -7.75,-3; 20 -7.75,-3.5; 21 -7.75,-4; 22 -7.75,-4.5; 23 -7.75,-5; 24 -7.75,-5.5; 25 -7.75,-6; 51 7.75,-6; 52 7.75,-5.5; 53 7.75,-5; 54 7.75,-4.5; 55 7.75,-4; 56 7.75,-3.5; 57 7.75,-3; 58 7.75,-2.5; 59 7.75,-2; 60 7.75,-1.5; 61 7.75,-1; 62 7.75,-0.5; 63 7.75,0; 64 7.75,0.5; 65 7.75,1; 66 7.75,1.5; 67 7.75,2; 68 7.75,2.5; 69 7.75,3; 70 7.75,3.5; 71 7.75,4; 72 7.75,4.5; 73 7.75,5; 74 7.75,5.5; 75 7.75,6 | smd 0.3 x 1.327: 26 -6,-7.75; 27 -5.5,-7.75; 28 -5,-7.75; 29 -4.5,-7.75; 30 -4,-7.75; 31 -3.5,-7.75; 32 -3,-7.75; 33 -2.5,-7.75; 34 -2,-7.75; 35 -1.5,-7.75; 36 -1,-7.75; 37 -0.5,-7.75; 38 0,-7.75; 39 0.5,-7.75; 40 1,-7.75; 41 1.5,-7.75; 42 2,-7.75; 43 2.5,-7.75; 44 3,-7.75; 45 3.5,-7.75; 46 4,-7.75; 47 4.5,-7.75; 48 5,-7.75; 49 5.5,-7.75; 50 6,-7.75; 76 6,7.75; 77 5.5,7.75; 78 5,7.75; 79 4.5,7.75; 80 4,7.75; 81 3.5,7.75; 82 3,7.75; 83 2.5,7.75; 84 2,7.75; 85 1.5,7.75; 86 1,7.75; 87 0.5,7.75; 88 0,7.75; 89 -0.5,7.75; 90 -1,7.75; 91 -1.5,7.75; 92 -2,7.75; 93 -2.5,7.75; 94 -3,7.75; 95 -3.5,7.75; 96 -4,7.75; 97 -4.5,7.75; 98 -5,7.75; 99 -5.5,7.75; 100 -6,7.75
8-LEADSOIC = smd 1.55 x 0.6: 1 -2.7,1.905; 2 -2.7,0.635; 3 -2.7,-0.635; 4 -2.7,-1.905; 5 2.7,-1.905; 6 2.7,-0.635; 7 2.7,0.635; 8 2.7,1.905
RTA-PACKAGE = smd 1 x 0.22: 1 -3.1,2.25; 2 -3.1,1.75; 3 -3.1,1.25; 4 -3.1,0.75; 5 -3.1,0.25; 6 -3.1,-0.25; 7 -3.1,-0.75; 8 -3.1,-1.25; 9 -3.1,-1.75; 10 -3.1,-2.25; 21 3.1,-2.25; 22 3.1,-1.75; 23 3.1,-1.25; 24 3.1,-0.75; 25 3.1,-0.25; 26 3.1,0.25; 27 3.1,0.75; 28 3.1,1.25; 29 3.1,1.75; 30 3.1,2.25 | smd 0.22 x 1: 11 -2.25,-3.1; 12 -1.75,-3.1; 13 -1.25,-3.1; 14 -0.75,-3.1; 15 -0.25,-3.1; 16 0.25,-3.1; 17 0.75,-3.1; 18 1.25,-3.1; 19 1.75,-3.1; 20 2.25,-3.1; 31 2.25,3.1; 32 1.75,3.1; 33 1.25,3.1; 34 0.75,3.1; 35 0.25,3.1; 36 -0.25,3.1; 37 -0.75,3.1; 38 -1.25,3.1; 39 -1.75,3.1; 40 -2.25,3.1 | smd 4.15 x 4.15: 41 0,0 | drill 0.2 pad 0.3: 41_1 0.685,-1.825; 41_2 0.685,-0.685; 41_3 0.685,0.685; 41_4 0.685,1.825; 41_5 1.825,-0.685; 41_6 1.825,0.685; 41_7 -0.685,-1.825; 41_8 -0.685,-0.685; 41_9 -0.685,0.685; 41_10 -0.685,1.825; 41_11 -1.825,-0.685; 41_12 -1.825,0.685
SOT-23-6-THIN = smd 1.1 x 0.6: 1 -1.35,0.95; 2 -1.35,0; 3 -1.35,-0.95; 4 1.35,-0.95; 5 1.35,0; 6 1.35,0.95
DFN6-3X3 = smd 0.85 x 0.45: 1 -1.45,1; 2 -1.45,0; 3 -1.45,-1; 4 1.45,-1; 5 1.45,0; 6 1.45,1 | smd 1.6 x 2.5: EXP 0,0
QFN16 = smd 0.85 x 0.3: 1 -1.475,0.75; 2 -1.475,0.25; 3 -1.475,-0.25; 4 -1.475,-0.75; 9 1.475,-0.75; 10 1.475,-0.25; 11 1.475,0.25; 12 1.475,0.75 | smd 0.3 x 0.85: 5 -0.75,-1.475; 6 -0.25,-1.475; 7 0.25,-1.475; 8 0.75,-1.475; 13 0.75,1.475; 14 0.25,1.475; 15 -0.25,1.475; 16 -0.75,1.475 | smd 1.7 x 1.7: TH 0,0
M80-8430342 = drill 0.8: 1 2,0; 2 0,0; 3 -2,0 | drill 0.9: P$4 4.25,-0.5; P$5 -4.25,-0.5; P$6 -4.25,-5.25; P$7 4.25,-5.25
SM07B-SRSS-TB = smd 0.6 x 1.55: 1 -3,2.975; 2 -2,2.975; 3 -1,2.975; 4 0,2.975; 5 1,2.975; 6 2,2.975; 7 3,2.975 | smd 1.2 x 1.8: FIT@1 -4.3,-0.9; FIT@2 4.3,-0.9
XT30 = drill 1.7: + -2.5,0; - 2.5,0
18_AWG_PAD = drill 1.4: 1 0,0

### Placement (x,y rotation side)
C1  47.99,35.67 90 top
C2  44.56,36.56 270 top
C3  40.24,48.24 0 top
C4  26.52,47.61 180 top
C5  48.62,42.53 270 top
C6  46.46,45.07 90 top
C7  39.99,28.56 180 top
C8  47.35,42.53 270 top
C9  44.56,45.07 90 top
C10  29.95,48.24 180 top
C11  46.46,35.67 90 top
C12  24.87,32.11 90 top
C13  45.57,42.27 90 top
C14  39.99,26.91 180 top
C15  44.56,39.86 90 top
C16  24.11,34.27 0 top
C17  20.43,33.76 270 top
C18  14.21,37.57 0 top
C19  6.2,48.88 180 top
C20  44.69,1.38 0 top
C21  44.69,3.03 0 top
C22  10.01,38.46 0 top
C23  14.46,40.49 90 top
C24  5.32,24.11 0 top
C25  4.81,22.08 0 top
C26  11.16,29.19 0 top
C27  23.19,40.62 90 top
C28  3.03,43.41 180 top
C29  3.92,20.17 180 top
C30  24.94,26.33 0 top
C31  21.19,40.62 90 top
C32  7.47,19.54 270 top
C33  17.13,26.02 0 top
C34  10.78,44.18 270 top
C35  23.09,14.71 90 top
C36  4.81,14.71 90 top
C37  30.71,14.71 90 top
C38  25.25,14.71 90 top
C39  28.56,14.71 90 top
C40  38.08,15.22 180 top
C41  42.27,7.73 180 top
C42  42.27,5.19 180 top
C43  2.65,14.71 90 top
C44  6.97,14.71 90 top
C45  47.48,7.73 0 top
C46  47.48,5.19 0 top
C47  47.48,10.27 0 top
C48  47.48,12.81 0 top
C49  42.27,12.81 180 top
C50  42.27,10.27 180 top
D1  34.78,25.89 180 top
D2  33.76,48.24 180 top
D3  10.39,41.26 0 top
FB1  44.69,48.24 270 top
G1  46.97,39.1 90 top
L1  6.97,44.69 180 top
Q1  4.68,8.24 270 top
Q2  11.03,7.6 90 top
Q3  23.73,8.24 270 top
Q4  17.38,7.6 90 top
Q5  30.08,8.24 270 top
Q6  36.43,7.6 90 top
R1  8.74,33.13 180 top
R2  8.74,34.65 0 top
R3  48.88,44.69 180 top
R4  44.05,27.41 0 top
R5  37.45,28.05 90 top
R6  36.94,48.24 0 top
R7  19.29,27.79 0 top
R8  16.87,29.19 0 top
R9  1.5,40.24 90 top
R10  1.5,37.95 90 top
R11  12.68,14.08 270 top
R12  17.89,14.08 270 top
S1  47.86,30.71 90 top
U1  34.65,38.46 180 top
U2  15.73,33.76 180 top
U3  11.66,23.48 45 top
U4  4.93,40.11 0 top
U5  17.51,40.37 180 top
U6  25,25 0 bottom
X1  6.2,30.33 270 top
X2  18.27,47.73 180 top
X3  44.69,19.79 0 top
X4  9.12,1.76 0 top
X5  21.82,1.76 0 top
X6  34.52,1.76 0 top

### Tracks (layer width: path | path; a pad name or v marks a point on that pad's centre or on a via)
+3V3  (via drill 0.3, 0.35)
  Top 0.2: U3.24 15.27,26.02 C33.1 16.53,26.4 17.03,26.91 v17.63,26.91 | v44.56,28.43 44.56,27.42 R4.2 | R8.2 18.45,29.19 v18.52,29.12 | R7.2 v19.79,28.8 v19.79,28.81 | X2.1 21.27,43.49 v21.19,43.41 | FB1.1 43.76,49.09 v43.44,49.41 | U1.6 46.36,34.96 C11.1 C1.1 48.02,35.03 v49,35.03 | U5.1 20.81,39.37 C31.1 21.29,39.84 v22.19,39.84 | v23.86,32.43 24.78,31.51 C12.1 25.16,31.51 26.11,32.46 U1.75 | v27.12,48.53 C4.1 27.64,47.61 28.65,46.59 U1.50 | v38.46,48.24 C3.1 39.65,48.23 U1.28 | v45.45,37.19 45.41,37.16 C2.1 44.25,37.46 U1.11 | U1.19 45.36,41.46 C13.1 46.43,41.67 v46.46,41.64 | C14.1 C7.1 | C7.1 v41.64,28.56 | C7.1 40.65,28.62 U1.100 | v12.96,38.49 12.96,37.96 13.35,37.57 C18.1 13.35,37.32 13.35,35.99 U2.5 | C30.1 24.34,27.44 v24.26,27.51
  Bottom 0.2: U6.13 24.25,27.5 v24.26,27.51
  other vias: 24.35,39.84
  pour Power (no thermals): 50.53,50.4 50.53,26.91 35.92,26.91 34.02,25 34.02,23.98 28.43,18.4 28.18,18.14 -0.27,18.14 -0.27,50.53 50.53,50.53
  pour Top (no thermals): 18.65,39.22 25,39.22 25,39.99 24.75,40.24 20.3,40.24 19.79,39.73 18.65,39.73
+5V
  Top 0.2: U5.5 15.77,40.08 15.58,39.89 C23.1 14.42,39.86 | U5.6 15.77,39.66 | 20.39,34.4 C17.1 | 10.9,45.18 11.9,45.18 12.43,45.7 12.43,46.59 10.9,48.11 5.32,48.11 0.54,43.34 0.54,41.45 1.26,40.74 R9.2
  Top 0.254: 15.77,39.66 15.77,40.08 | C23.1 15.53,39.89 U5.6 | U2.3 20.39,34.4 | 13.44,39.86 13.44,39.1 14,38.54 17.43,38.54 20.43,35.54 C17.1 | 14.42,39.86 13.44,39.86 | 11.28,45.18 10.9,45.18 C34.1 11.94,45.18 13.44,43.67 13.44,39.86
  pour Top (no thermals): 15.4,40.54 16.44,40.54 16.44,39.19 15.13,39.19 14.84,39.48 13.37,39.48 13.37,40.37 15.22,40.37
  pour Top (no thermals): 11.54,45.7 9.76,45.7 9,46.46 5.57,46.46 5.57,45.19 9,45.19 9.63,44.56 11.54,44.56
+24V  (via drill 0.3)  (1 unrouted)
  Top 0.2: R1.2 7.99,33.38 2.03,33.38 | C21.1 40.49,3.03 39.61,3.92 39.61,15.2 C40.1 42.19,17.82 X3.+ | C44.1 7.88,13.21 8.44,13.78 8.44,20.61 U3.5 | C32.1 7.54,20.41 | 9.04,21.92 U3.4 7.57,20.45 7.44,20.45
  Top 0.305: 7.54,20.41 C32.1 7.44,20.45
  Top 0.406: U4.5 7.32,40.11 8.51,38.92 C22.1 6.1,36.05 4.7,36.05 2.03,33.38 2.03,25.64 1.14,24.74 1.14,14.6 2.52,13.21 C43.1
  other vias: 44.43,13.44 43.41,13.44 43.41,11.54 44.43,11.54 43.41,9 44.43,9 43.41,6.46 44.43,6.46 44.56,4.55 43.41,4.55
  pour Bottom (no thermals): -0.65,11.03 10.27,11.03 10.27,10.01 10.9,9.38 19.67,9.38 20.3,10.01 20.3,11.03 38.59,11.03 38.84,11.28 38.84,12.94 38.21,13.57 36.3,13.57 36.3,19.54 37.83,21.06 43.23,21.06 44.81,19.48 44.81,-0.53 -0.65,-0.53
  pour Top (no thermals): 6.84,7.35 6.84,13.82 2.52,13.82 2.52,7.35
  pour Top (no thermals): 25.89,13.82 25.89,7.35 21.57,7.35 21.57,13.82
  pour Top (no thermals): 27.92,13.82 27.92,7.35 32.24,7.35 32.24,13.82
  pour Power (no thermals): -0.65,11.03 38.59,11.03 38.84,11.28 38.84,12.94 38.21,13.57 36.3,13.57 36.3,19.54 37.83,21.06 43.23,21.06 44.81,19.48 44.81,-0.53 -0.65,-0.53
  pour Top (no thermals): 43.03,13.7 46.72,13.7 46.72,4.3 43.03,4.3
  pour Top (no thermals): 1,22.71 1,21.44 3.54,21.44 4.55,20.43 4.55,19.29 6.46,19.29 6.97,19.79 7.47,19.79 7.98,20.3 7.98,20.68 8.24,20.94 8.24,21.19 5.06,21.19 4.55,21.7 4.55,22.71
BODY1  (via drill 2.1 pad 3.8)
  Top 0.152: C19.2 4.84,48.88 3.84,47.87 v2.03,47.97
BODY2  (via drill 2.1 pad 3.8)
  Top 0.2: C21.2 46.97,3.03 v47.97,2.03 47.04,1.38 C20.2
BOOT0
  Top 0.152: U1.94 37.65,28.75 R5.2
CAN_RX
  Top 0.152: U2.4 17.76,35.67 17,34.91 17,31.1 18.08,30.02 25.02,30.02 28,27.03 34.78,27.03 37.15,29.41 U1.93 37.1,30.77 37.1,31.43 37.39,31.71 37.92,31.71 38.2,31.43 38.2,30.77 U1.95
CAN_TX
  Top 0.152: U2.1 19.73,30.56 25.29,30.56 28.18,27.67 34.65,27.67 36.65,29.67 U1.92 36.6,30.77 36.6,31.81 37.03,32.24 38.21,32.24 38.65,31.8 U1.96
CANH
  Top 0.152: X1.2 10.01,30.33 12.81,33.13 U2.7
CANL
  Top 0.152: U2.6 12.55,34.4 10.49,32.33 X1.3
CB
  Top 0.152: U4.1 2.15,42.49 C28.2
CPH
  Top 0.152: U3.2 8.31,22.63 7.81,22.13 7.3,22.13 5.96,23.46 5.34,23.46 4.85,23.95 4.71,23.95 C24.1
CPL
  Top 0.152: U3.1 7.15,22.88 C24.2
CS  (via drill 0.3)
  Top 0.152: v30.14,28.37 29.13,28.37 28.56,28.93 28.56,29.28 29.15,29.87 U1.77
  Bottom 0.152: v30.14,28.37 30.46,28.05 30.46,26.91 27.08,23.52 U6.5
D1
  Top 0.152: R4.1 42.03,25.89 D1.A
D2
  Top 0.152: R6.1 D2.A
DVDD
  Top 0.2: U3.33 9.9,27.01 9.9,28.03 10.56,28.68 C26.1
ENABLE  (via drill 0.3)
  Top 0.152: U3.37 7.94,26.14 v7.73,26.14 | U3.35 8.81,26.69 v8.81,27.22 | v23.04,35.8 23.87,34.96 U1.70 | U3.39 7.79,24.87 v7.22,24.87 | U3.30 11.66,27.86 v11.66,28.05
  Bottom 0.152: v7.22,24.87 7.73,25.38 v7.73,26.14 v8.81,27.22 9.57,27.22 11.03,28.68 | 11.03,28.68 18.14,35.8 v23.04,35.8 | v11.66,28.05 11.03,28.68
FAULT  (via drill 0.3)
  Top 0.152: U3.25 15.35,26.81 16.15,26.81 17.14,27.79 v17.63,27.79 R7.1
FB
  Top 0.152: U4.3 3.53,39.11 2.27,39.11 1.51,39.11 1.5,39.1 | R9.1 1.5,39.1 | 1.5,39.1 R10.2
GHA
  Top 0.2: Q1.4 7.35,6.23 7.35,11.16 8.97,12.78 8.97,20.43 U3.6
GHB
  Top 0.2: 14.85,19.94 15.77,19.94 18.2,17.51 26.23,17.51 26.62,17.12 26.62,6.96 25.64,5.97 Q3.4 | U3.15 14.85,19.94 | 14.85,19.94
GHC
  Top 0.2: Q5.4 31.98,5.95 32.75,6.71 32.75,16.74 31.52,17.98 18.4,17.98 15.97,20.41 15.09,20.41 13.93,21.57 U3.16
GLA
  Top 0.2: Q2.4 9.07,10.43 9.07,10.91 9.92,11.77 9.92,19.97 U3.8
GLB
  Top 0.2: Q4.4 14.59,11.26 14.59,18.79 U3.13
GLC
  Top 0.2: 15.61,21.3 16.34,21.3 18.77,18.87 31.88,18.87 33.64,17.12 33.64,11.66 34.52,10.78 Q6.4 | U3.18 15.61,21.3 | 15.61,21.3
GND  (via drill 0.2, 0.2 pad 0.2, 0.2 pad 0.25, 0.3, 0.35)  (2 unrouted)
  Top 0.152: 12.55,14.76 12.12,14.33 11.33,14.33 10.9,14.76 10.9,19.53 11.17,19.8 U3.10 | v15.98,18.27 15.98,14.84 16.36,14.46 16.87,14.46 R12.1 | 17.41,15.08 17.41,15.12 | Q6.3 35.8,10.97 34.09,12.68 34.09,17.3 31.94,19.44 18.82,19.44 16.51,21.76 15.86,21.76 U3.19 U3.20 | C5.2 48.4,41.71 | v18.79,25.89 18.66,26.02 C33.2 | v12.94,29.19 C26.2 | 20.39,33.13 C17.2 | C18.2 14.71,37.48 v14.71,36.18 | D2.C v31.73,48.24 | 47.1,41.67 C8.2 C5.2 | C10.2 v28.28,48.23 | X2.3 19.27,43.43 v19.29,43.41 | U1.10 43.39,36.96 44.4,35.96 C2.2 45.41,35.96 v45.45,35.92 | v49.51,41.89 48.66,41.89 C5.2 | U3.11 12.68,19.28 v12.68,18.27 | C4.2 25.92,48.48 v26.04,48.6 | C11.2 C1.2 | C16.1 v22.46,34.27 | v23.86,33.38 24.2,33.38 C12.2 25.12,32.96 U1.74 | U1.20 44.28,41.96 45.19,42.87 C13.2 45.57,42.78 v46.46,42.78 | R10.1 v0.62,37.45 | D1.C v32.75,25.89 | C15.2 44.59,40.49 v45.45,40.49 | C30.2 25.41,26.33 25.16,26.08 25.16,25.16 U6.TH
  Top 0.2: U5.4 14.73,41.37 C23.2 | C31.2 C27.2 24.35,41.5 v24.36,41.51 | U5.4 17.02,41.37 17.51,40.88 U5.EXP | U1.27 40.15,47.14 40.84,47.83 C3.2 v41.82,48.24 | C10.2 29.15,48.04 U1.49 | U1.99 40.15,29.58 39.39,28.81 C7.2 | U3.32 11.66,25.95 11.66,25.89 11.03,25.25 U3.41_4 | 21.41,33.16 v21.44,33.13 | U2.8 14.97,31.86 v14.99,31.83 | 4.05,40.11 U4.2 v2.39,40.11 | R5.1 v36.18,27.55 v36.18,27.54 | v48.37,38.72 47.99,39.1 G1.2 | C32.2 7.44,18.7 | C6.2 47.3,45.67 v47.44,45.52 | C9.2 43.7,45.67 v43.67,45.7 | Q6.1 39.2,9.5 39.2,3.75 40.33,2.63 42.83,2.63 C20.1 | C19.1 6.93,49 v7.98,49 | U3.20 15.34,22.98 | U5.4 15.98,41.44 | R2.1 v7.22,34.65 | C1.2 48.97,36.27 v49,36.3 | C2.2 44.56,35.92 | C14.2 C7.2 | C7.2 v38.34,28.56 | U3.40 8.48,23.48 U3.41_9 | S1.2 46.99,27.79 v45.95,27.79 | S1.1 47.01,32.36 v47.05,32.32 | R12.1 v17.89,15.47 v18.52,15.47
  Top 0.203: v12.67,15.47 R11.1 | v11.41,14.84 11.54,14.97 11.54,15.18 11.84,15.47 v12.67,15.47 | 12.55,14.76 12.55,14.84 12.67,14.96 v12.67,15.47
  Top 0.254: U2.2 20.39,33.13 | C17.2 21.41,33.16
  Bottom 0.152: v12.68,18.27 v15.98,18.27 | U6.8 24.25,24.25 U6.TH
  other vias: 13.32,16.11 11.41,16.11 12.05,16.11 12.68,16.11 11.41,15.47 12.05,15.47 13.32,15.47 30.08,16.62 30.71,16.62 31.35,16.62 30.08,15.09 30.71,15.09 31.35,15.09 27.92,16.62 28.56,16.62 29.19,16.62 27.92,15.09 28.56,15.09 29.19,15.09 24.62,16.62 25.25,16.62 25.89,16.62 24.62,15.09 25.25,15.09 25.89,15.09 22.46,16.62 23.09,16.62 23.73,16.62 22.46,15.09 23.09,15.09 23.73,15.09 4.17,16.62 4.81,16.62 5.44,16.62 4.17,15.09 4.81,15.09 5.44,15.09 6.33,16.62 6.97,16.62 7.6,16.62 6.33,15.09 6.97,15.09 7.6,15.09 2.01,16.62 2.65,16.62 3.28,16.62 2.01,15.09 2.65,15.09 3.28,15.09 13.32,14.84 12.05,14.84 12.68,14.84 13.95,14.84 13.95,15.47 13.95,16.11 18.52,16.11 16.62,16.11 17.25,16.11 17.89,16.11 16.62,15.47 18.52,14.84 17.89,14.84 19.16,14.84 19.16,15.47 19.16,16.11 5.95,18.52 37.57,11.66 35.67,11.66 36.3,11.66 36.94,11.66 38.21,11.66 38.21,12.3 38.21,12.94 37.57,12.94 35.67,12.94 36.3,12.94 36.94,12.94 35.67,12.3 36.3,12.3 36.94,12.3 37.57,12.3 48.62,4.55 49.38,6.46 48.62,6.46 49.38,9 48.62,9 49.38,11.54 48.62,11.54 49.38,13.44 48.62,13.44 49.38,4.55 15.22,41.26 17.51,41.13 17.51,40.37 17.51,39.61 22.21,41.51 17.25,15.47 17.25,14.84 16.62,14.84 9.38,43.41 10.14,38.97 25,25 3.66,18.52 4.81,18.52 2.52,18.52
  pour Ground (no thermals): 50.53,50.4 50.53,26.91 35.92,26.91 34.02,25 34.02,23.98 28.43,18.4 28.18,18.14 16.87,18.14 16.11,18.9 12.68,18.9 11.92,18.14 -0.27,18.14 -0.27,50.53 50.53,50.53
  pour Bottom (no thermals): 50.4,25.38 37.7,25.38 29.45,17.13 -0.65,17.13 -0.65,11.41 10.27,11.41 10.27,13.57 11.03,14.33 19.54,14.33 20.3,13.57 20.3,11.41 38.34,11.41 38.46,11.54 38.46,12.68 37.95,13.19 35.92,13.19 35.92,19.67 37.7,21.44 43.41,21.44 45.19,19.67 45.19,-0.53 50.4,-0.53
  pour Top (no thermals): 1.63,17 1.63,14.84 7.98,14.84 7.98,17
  pour Top (no thermals): 22.08,17 22.08,14.84 26.27,14.84 26.27,17
  pour Top (no thermals): 27.54,17 27.54,14.84 31.73,14.84 31.73,17
  pour Power (no thermals): 50.4,25.38 37.7,25.38 29.45,17.13 -0.65,17.13 -0.65,11.41 35.16,11.41 35.16,13.06 35.67,13.57 35.92,13.57 35.92,19.67 37.7,21.44 43.41,21.44 45.19,19.67 45.19,-0.53 50.4,-0.53
  pour Ground (no thermals): 50.4,25.38 37.7,25.38 29.45,17.13 28.81,17.13 1.5,17.13 1.5,18.4 0.74,18.4 0.74,17.13 -0.65,17.13 -0.65,11.41 35.16,11.41 35.16,13.06 35.67,13.57 35.92,13.57 35.92,19.67 37.7,21.44 43.41,21.44 45.19,19.67 45.19,-0.53 50.4,-0.53
  pour Top (no thermals): 38.59,9.76 38.59,13.19 37.19,13.19 37.19,15.22 36.18,15.22 35.54,14.59 35.54,9.76
  pour Bottom (no thermals): 12.81,27.41 18.78,21.44 18.78,19.41 1.12,19.41 1.12,21.95 3.03,23.86 7.86,23.86 11.41,27.41
  pour Top (no thermals): 14.08,40.75 15.09,40.75 15.47,41.13 16.87,41.13 16.87,41.64 14.33,41.64 14.08,41.38
  pour Top (no thermals): 20.68,41.89 25,41.89 25,41.38 24.62,41 20.68,41
  pour Top (no thermals): 40.11,4.3 40.11,13.7 40.49,13.7 40.75,13.95 40.75,14.71 41.38,15.35 44.69,15.35 45.19,15.86 45.19,20.43 46.08,21.32 47.86,21.32 48.75,20.43 48.75,19.16 47.86,18.27 47.1,18.27 46.34,17.51 46.34,14.84 45.83,14.33 42.4,14.33 41.38,13.32 41.38,4.3
  pour Top (no thermals): 48.24,13.7 48.24,4.3 49.77,4.3 49.77,13.7
  pour Top (no thermals): 10.9,37.57 9.89,38.59 9.89,39.35 10.9,39.35 10.9,39.73 11.66,40.49 11.66,41.89 10.9,42.65 9.76,42.65 9.12,43.29 9.12,43.67 11.41,43.67 12.94,42.14 12.94,40.49 12.17,39.73 12.17,37.57
  pour Top (no thermals): 6.59,18.9 7.09,19.41 7.86,19.41 7.98,19.29 7.98,18.65 7.47,18.14 2.14,18.14 1.76,18.52 1.76,19.67 3.16,19.67 3.92,18.9
I_A  (via drill 0.3)
  Top 0.152: v40.62,39.48 42.39,39.48 U1.15 | U3.23 15.21,25.25 20.17,25.25 v20.3,25.13
  Bottom 0.152: v20.3,25.13 23.86,28.68 27.67,28.68 38.46,39.48 v40.62,39.48
I_B  (via drill 0.3)
  Top 0.152: v17.25,24.49 16.87,24.87 15.54,24.87 U3.22 | v39.61,40.11 41,40.11 41.15,39.96 U1.16
  Bottom 0.152: v17.25,24.49 18.78,24.49 23.35,29.06 27.54,29.06 38.59,40.11 v39.61,40.11
INDICATOR
  Top 0.152: U1.34 36.65,47.19 37.44,47.98 R6.2
MISO  (via drill 0.3)
  Top 0.152: U1.79 30.15,29.25 v31.1,28.3
  Bottom 0.152: U6.7 24.75,22.96 25.25,22.46 27.03,22.46 31.1,26.52 v31.1,28.3
MOSI  (via drill 0.3)
  Top 0.152: U1.80 30.73,30.64 30.73,29.74 30.97,29.5 v30.97,29.31
  Bottom 0.152: U6.4 26.92,24.25 29.45,26.78 29.45,28.48 30.27,29.31 v30.97,29.31
N$2  (via drill 2.1 pad 3.8)
  other vias: 2.03,2.03
N$4  (via drill 2.1 pad 3.8)
  other vias: 47.97,47.97
NRST  (via drill 0.3, 0.35)
  Top 0.152: X2.5 17.27,45.72 17.76,46.21 27.41,46.21 35.04,38.58 41.13,38.58 41.51,38.96 U1.14 43.59,38.96 v43.67,39.04 43.89,39.26 C15.1 | S1.3 48.75,27.85 48.75,29.57 48.11,30.21 48.11,32.13 48.68,32.69 48.68,33.58 S1.4 v49.34,33.62
  Bottom 0.152: v43.67,39.04 43.67,35.54 45.45,33.76 49.2,33.76 v49.34,33.62
OSC_IN
  Top 0.152: G1.1 46.91,37.96 U1.12
OSC_OUT
  Top 0.152: G1.3 46.27,40.3 45.7,39.73 45.7,38.97 45.19,38.46 U1.13
PA0_SENSE  (via drill 0.3)
  Top 0.152: R2.2 9.24,33.89 | 9.24,33.89 R1.1 | 9.24,33.89 v9.89,33.89 | v40.49,43.41 42.36,43.41 U1.23
  Bottom 0.152: v9.89,33.89 11.61,33.89 16.44,38.72 30.21,38.72 34.91,43.41 v40.49,43.41
PHASA
  Top 0.152: Q2.5_5 7.87,9.36 7.87,10.88 9.44,12.45 9.44,20.23 9.96,20.75 U3.7
  pour Ground (no thermals): -0.27,7.09 7.35,7.09 7.86,7.6 7.86,8.87 8.24,9.25 13.82,9.25 13.82,-0.65 -0.53,-0.65 -0.53,7.09
  pour Top (no thermals): -0.53,6.71 6.08,6.71 6.08,4.43 6.97,4.43 7.86,5.32 7.86,7.73 8.62,8.49 13.82,8.49 13.82,-0.65 -0.53,-0.65
PHASB
  Top 0.152: Q4.5_13 17.38,6.59 19.92,9.12 19.92,16.36 19.29,17 18.08,17 15.59,19.49 14.59,19.49 13.22,20.86 U3.14
  pour Ground (no thermals): 14.21,9.25 20.05,9.25 20.43,8.87 20.43,7.73 21.06,7.09 26.78,7.09 26.78,-0.65 14.21,-0.65
  pour Top (no thermals): 14.21,8.49 19.67,8.49 21.44,6.71 25,6.71 25,4.55 26.27,4.55 26.4,4.68 26.78,4.68 26.78,-0.65 14.21,-0.65
PHASC
  Top 0.152: Q6.5_5 33.19,9.44 33.19,16.93 31.7,18.42 18.58,18.42 16.15,20.85 15.35,20.85 14.28,21.92 U3.17
  pour Ground (no thermals): 27.16,7.09 27.16,-0.65 43.41,-0.65 43.41,9.38 33.76,9.38 33.26,8.87 33.26,7.47 32.87,7.09
  pour Top (no thermals): 27.16,6.71 27.16,-0.65 43.41,-0.65 43.41,2.1 42.91,2.52 40.37,2.52 39.22,3.66 39.22,8.49 34.27,8.49 33.64,7.86 33.64,7.47 32.87,6.71
PWMA  (via drill 0.3)
  Top 0.152: v8.24,28.81 7.1,27.68 7.1,25.88 7.47,25.52 7.86,25.52 U3.38 | v23.48,37.83 23.6,37.7 23.6,36.3 24.44,35.46 U1.69
  Bottom 0.152: v8.24,28.81 17.25,37.83 v23.48,37.83
PWMB  (via drill 0.3)
  Top 0.152: U3.36 7.86,26.93 v7.86,27.41 | v24.36,37.01 24.36,36.43 24.87,35.92 26.86,35.92 U1.68
  Bottom 0.152: v7.86,27.41 17.51,37.06 24.31,37.06 v24.36,37.01
PWMC  (via drill 0.3)
  Top 0.152: U3.34 9.44,26.76 9.44,27.73 v9.25,27.92 | v25.38,36.56 25.51,36.56 25.6,36.46 U1.67
  Bottom 0.152: v9.25,27.92 17.76,36.43 25.25,36.43 v25.38,36.56
SCK  (via drill 0.3)
  Top 0.152: U1.78 29.67,30.69 29.67,29.67 29.39,29.39 v29.39,29.29
  Bottom 0.152: v29.39,29.29 29.39,29.2 28.37,28.18 24.11,28.18 23.35,27.41 23.35,25.93 U6.12
SPA  (via drill 0.2, 0.2 pad 0.25)
  Top 0.152: 11.77,13.19 10.36,14.6 10.36,19.69 U3.9
  Top 0.203: 11.77,13.19 v12.05,13.19
  other vias: 13.32,13.19 11.41,13.19 12.68,13.19 11.41,12.55 12.05,12.55 12.68,12.55 13.32,12.55 13.32,11.92 11.41,11.92 12.05,11.92 12.68,11.92 13.95,11.92 13.95,12.55 13.95,13.19
  pour Bottom (no thermals): 10.65,13.44 10.65,10.14 11.03,9.76 14.71,9.76 15.09,10.14 15.09,13.44 14.59,13.95 11.16,13.95
  pour Top (no thermals): 14.21,13.44 14.21,9.76 10.14,9.76 10.14,11.28 10.52,11.66 10.52,13.44
SPB  (via drill 0.2, 0.2 pad 0.2, 0.2 pad 0.25, 0.3)
  Top 0.152: v15.35,18.91 15.35,14.71 16.24,13.82 16.74,13.82 16.87,13.7 16.94,13.63 R12.2 | v13.31,18.92 13.31,19.42 12.57,20.15 U3.12
  Bottom 0.152: v15.35,18.91 v13.31,18.91 v13.31,18.92
  other vias: 18.52,11.92 16.62,11.92 17.25,11.92 17.89,11.92 19.16,11.92 19.16,12.55 19.16,13.19 18.52,13.19 16.62,13.19 17.25,13.19 17.89,13.19 16.62,12.55 17.25,12.55 17.89,12.55 18.52,12.55
  pour Bottom (no thermals): 15.47,13.44 15.47,10.14 15.86,9.76 19.54,9.76 19.92,10.14 19.92,13.44 19.41,13.95 15.98,13.95
  pour Top (no thermals): 19.54,13.44 19.54,9.76 16.24,9.76 16.24,11.28 15.73,11.79 15.73,13.44
SPI-MISO  (via drill 0.3)
  Top 0.152: U3.26 14.99,27.16 15.6,27.16 v16.36,27.92 R8.1 | v37.83,40.62 37.83,44.3 38.21,44.69 38.21,46.16 U1.31
  Bottom 0.152: v16.36,27.92 18.14,29.7 26.91,29.7 v37.83,40.62
SPI-MOSI  (via drill 0.3)
  Top 0.152: U3.27 14.16,27.03 14.33,27.03 v15.09,27.79 | v37.06,41.26 37.19,41.38 37.19,44.43 37.7,44.94 37.7,46.16 U1.32
  Bottom 0.152: v15.09,27.79 17.76,30.46 26.27,30.46 v37.06,41.26
SPI-NSS-DRV  (via drill 0.3)
  Top 0.152: U3.29 13.32,27.6 13.32,28.05 v13.95,28.68 | v39.1,42.53 39.1,46.16 U1.29
  Bottom 0.152: v39.1,42.53 36.3,42.53 25.64,31.86 17.13,31.86 v13.95,28.68
SPI-SCK  (via drill 0.3)
  Top 0.152: U3.28 13.95,27.53 v13.95,27.67 | U1.30 38.65,44.56 38.52,44.43 38.52,41.95 v38.46,41.89
  Bottom 0.152: v13.95,27.67 17.38,31.1 25.89,31.1 36.68,41.89 v38.46,41.89
SW
  pour Top (no thermals): 3.41,42.91 4.68,42.91 5.82,41.76 5.82,40.88 7.35,40.88 7.6,40.88 7.86,40.62 9.12,40.62 9.12,42.27 8.36,43.03 8.36,44.18 5.32,44.18 5.06,43.92 3.41,43.92
TCK
  Top 0.152: U1.76 28.65,33 29.8,34.14 29.8,43.32 27.29,45.83 20.87,45.83 20.27,45.22 X2.2
TMS
  Top 0.152: X2.4 18.27,43.29 19.03,42.53 22.97,42.53 25.76,45.32 27.29,45.32 29.32,43.29 29.32,35.48 27.8,33.96 U1.72
USART_RX
  Top 0.152: U1.26 41.41,46.21 42.4,47.2 42.4,48.62 41.76,49.26 25.89,49.26 23.22,46.59 16.24,46.59 15.27,45.62 X2.7
USART_TX
  Top 0.152: X2.6 16.24,44.73 16.24,43.8 15.73,43.29 14.97,43.29 14.33,43.92 14.33,45.57 15.86,47.1 22.97,47.1 25.64,49.77 42.27,49.77 43.04,49 43.04,45.1 42.96,45.02 U1.25
VCAP_1  (1 unrouted)
  Top 0.152: C10.1 30.55,48.22 29.65,47.32 29.65,47.23
  Top 0.2: U1.48 29.65,47.23 | 30.66,48.24 30.68,48.24
VCAP_2
  Top 0.2: C16.2 25,34.27 25.81,33.46 U1.73
VCP
  Top 0.2: U3.3 8.12,21.7 6.06,21.7 C25.2
VDDA
  Top 0.2: U1.22 43.29,42.96 44.56,44.23 C9.1 45.45,44.47 | 45.45,44.47 C6.1 46.72,44.72 48.34,44.72 R3.2 | 45.45,44.47 45.45,46.63 FB1.2
VREF+
  Top 0.152: R3.1 49.25,44.56 49.25,43.75 C5.1 C8.1 47.35,43.51 47.23,43.63 44.9,43.63 43.73,42.46 U1.21

### Text on the board
tPlace: Indicator | Power | BLDC controller | v2.4
tNames: U | V | W